# EAGLE design M0_Express_eh_shield_revc (EAGLE 9.6.2)

## Sheet 1 of 2
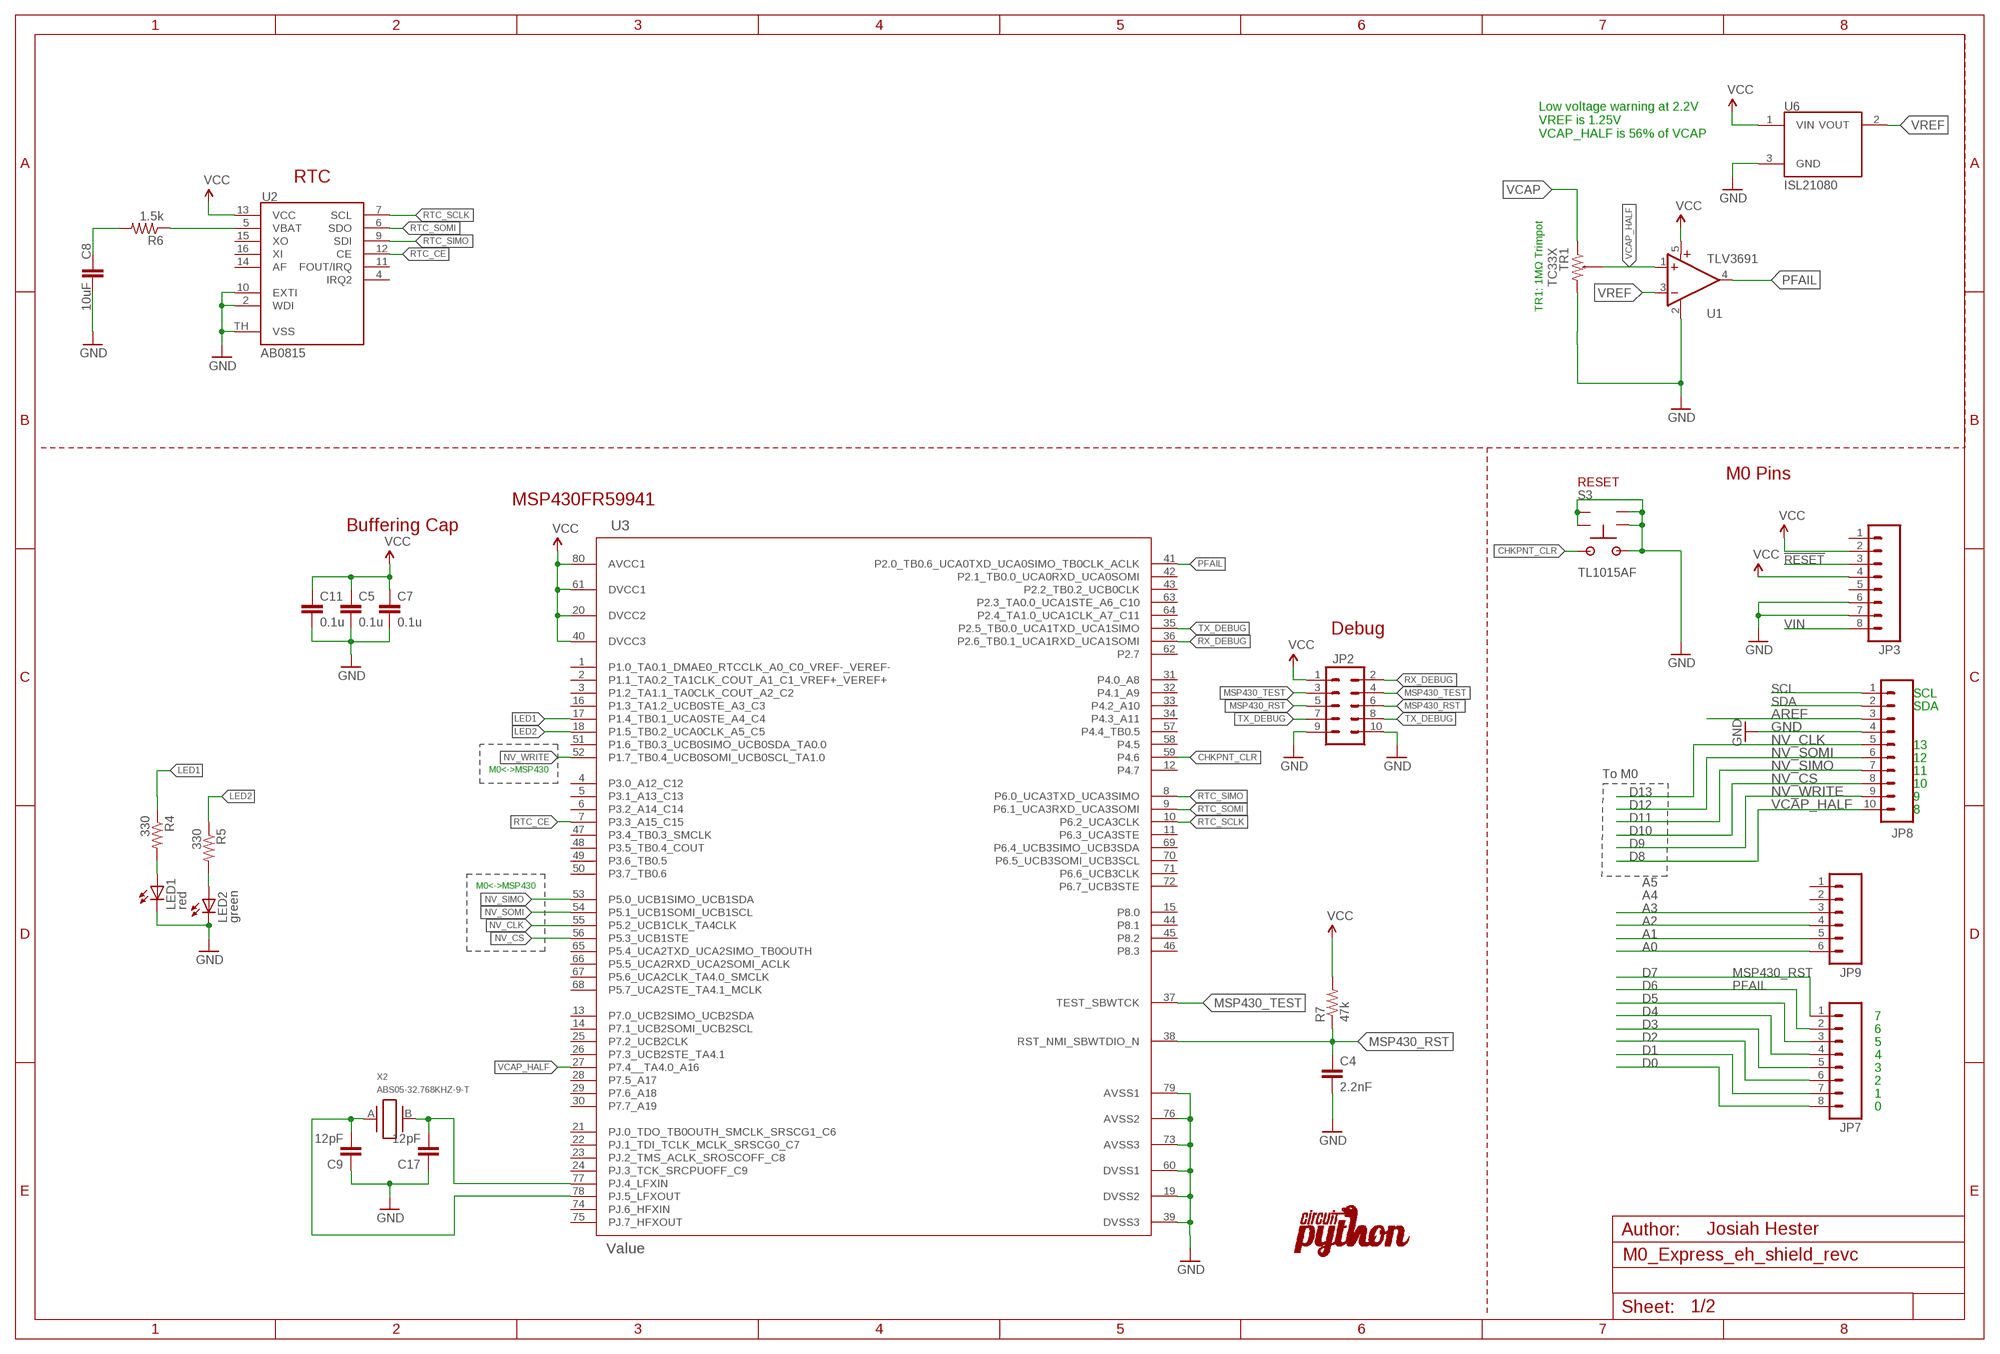
[diagram p0: schematic, sheet 1]

### Parts
C4  2.2nF  C-EU0603  [0603@1]
C5  0.1u  C-EU0603  [0603@1]
C7  0.1u  C-EU0603  [0603@1]
C8  10uF  CAP0805  [0805]
C9  12pF  C-EU0603  [0603@1]
C11  0.1u  C-EU0603  [0603@1]
C17  12pF  C-EU0603  [0603@1]
JP2  M05X21.27MM  [2X5_1.27MM]
JP3  M08LOCK  [1X08_LOCK]
JP7  M08LOCK  [1X08_LOCK]
JP8  M10LOCK  [1X10_LOCK]
JP9  M06LOCK  [1X06_LOCK]
LED1  red  LED0603  [LED-0603]
LED2  green  LED0603  [LED-0603]
R4  330  R-EU0603  [0603]
R5  330  R-EU0603  [0603]
R6  1.5k  R-EU0603  [0603]
R7  47k  R-EU0603  [0603]
S3  TL1015AF  [TS1015]
TR1  TC33X  [TC33X]
U1  TLV3691  [SC70-5]
U2  AB0815  [QFN16]
U3  Value  MSP430FR5994IPNR  [PN0080A_N]
U6  ISL21080  [SOT-23]
U$1  LOGO  [CIRCUITPYTHON-LOGO]
X2  ABS05-32.768KHZ-9-T  [ABS05]

### Nets
!RESET: JP3.3
A0: JP9.6
A1: JP9.5
A2: JP9.4
A3: JP9.3
AREF [aref]: JP8.3
CHKPNT_CLR: S3.2 U3.59(P4.6)
D0: JP7.8
D1: JP7.7
D2: JP7.6
D3: JP7.5
D4: JP7.4
D5: JP7.3
GND [gnd]: C4.2 C5.2 C7.2 C8.2 C9.1 C11.2 C17.1 JP2.9 JP2.10 JP3.6 JP3.7 JP8.4 LED1.C LED2.C S3.1 S3.G1(GND) S3.G2(GND) S3.G3(GND) S3.G4(GND) TR1.2 U1.2(GND) U2.2(WDI) U2.10(EXTI) U2.TH(VSS) U3.19(DVSS2) U3.39(DVSS3) U3.60(DVSS1) U3.73(AVSS3) U3.76(AVSS2) U3.79(AVSS1) U6.3(GND) ; also sheet 2
LED1: R4.1 U3.17(P1.4_TB0.1_UCA0STE_A4_C4)
LED2: R5.1 U3.18(P1.5_TB0.2_UCA0CLK_A5_C5)
MSP430_RST: C4.1 JP2.5 JP2.6 JP7.1 R7.1 U3.38(RST_NMI_SBWTDIO_N)
MSP430_TEST: JP2.3 JP2.4 U3.37(TEST_SBWTCK)
N$3: JP3.2 ; supply symbol labelled VCC
N$4: R6.1 U2.5(VBAT)
N$5: C17.2 U3.77(PJ.4_LFXIN) X2.B
N$6: C9.2 U3.78(PJ.5_LFXOUT) X2.A
N$8: C8.1 R6.2
N$14: LED1.A R4.2
N$15: LED2.A R5.2
NV_CLK: JP8.5 U3.55(P5.2_UCB1CLK_TA4CLK)
NV_CS: JP8.8 U3.56(P5.3_UCB1STE)
NV_SIMO: JP8.7 U3.53(P5.0_UCB1SIMO_UCB1SDA)
NV_SOMI: JP8.6 U3.54(P5.1_UCB1SOMI_UCB1SCL)
NV_WRITE: JP8.9 U3.52(P1.7_TB0.4_UCB0SOMI_UCB0SCL_TA1.0)
PFAIL: JP7.2 U1.4(OUT) U3.41(P2.0_TB0.6_UCA0TXD_UCA0SIMO_TB0CLK_ACLK)
RTC_CE: U2.12(CE) U3.7(P3.3_A15_C15)
RTC_SCLK: U2.7(SCL) U3.10(P6.2_UCA3CLK)
RTC_SIMO: U2.9(SDI) U3.8(P6.0_UCA3TXD_UCA3SIMO)
RTC_SOMI: U2.6(SDO) U3.9(P6.1_UCA3RXD_UCA3SOMI)
RX_DEBUG: JP2.2 U3.36(P2.6_TB0.1_UCA1RXD_UCA1SOMI)
SCL: JP8.1
SDA: JP8.2
TX_DEBUG: JP2.7 JP2.8 U3.35(P2.5_TB0.0_UCA1TXD_UCA1SIMO)
VCAP: TR1.1 ; also sheet 2
VCAP_HALF: JP8.10 TR1.W U1.1(+IN) U3.27(P7.4__TA4.0_A16)
VCC: C5.1 C7.1 C11.1 JP2.1 JP3.4 R7.2 U1.5(V+) U2.13(VCC) U3.20(DVCC2) U3.40(DVCC3) U3.61(DVCC1) U3.80(AVCC1) U6.1(VIN) ; also sheet 2
VIN [USB]: JP3.8
VREF: U1.3(-IN) U6.2(VOUT)
Unconnected: JP3.1 JP3.5 JP9.1 JP9.2 U2.4(IRQ2) U2.11(FOUT/IRQ) U2.14(AF) U2.15(XO) U2.16(XI) U3.1(P1.0_TA0.1_DMAE0_RTCCLK_A0_C0_VREF-_VEREF-) U3.2(P1.1_TA0.2_TA1CLK_COUT_A1_C1_VREF+_VEREF+) U3.3(P1.2_TA1.1_TA0CLK_COUT_A2_C2) U3.4(P3.0_A12_C12) U3.5(P3.1_A13_C13) U3.6(P3.2_A14_C14) U3.11(P6.3_UCA3STE) U3.12(P4.7) U3.13(P7.0_UCB2SIMO_UCB2SDA) U3.14(P7.1_UCB2SOMI_UCB2SCL) U3.15(P8.0) U3.16(P1.3_TA1.2_UCB0STE_A3_C3) U3.21(PJ.0_TDO_TB0OUTH_SMCLK_SRSCG1_C6) U3.22(PJ.1_TDI_TCLK_MCLK_SRSCG0_C7) U3.23(PJ.2_TMS_ACLK_SROSCOFF_C8) U3.24(PJ.3_TCK_SRCPUOFF_C9) U3.25(P7.2_UCB2CLK) U3.26(P7.3_UCB2STE_TA4.1) U3.28(P7.5_A17) U3.29(P7.6_A18) U3.30(P7.7_A19) U3.31(P4.0_A8) U3.32(P4.1_A9) U3.33(P4.2_A10) U3.34(P4.3_A11) U3.42(P2.1_TB0.0_UCA0RXD_UCA0SOMI) U3.43(P2.2_TB0.2_UCB0CLK) U3.44(P8.1) U3.45(P8.2) U3.46(P8.3) U3.47(P3.4_TB0.3_SMCLK) U3.48(P3.5_TB0.4_COUT) U3.49(P3.6_TB0.5) U3.50(P3.7_TB0.6) U3.51(P1.6_TB0.3_UCB0SIMO_UCB0SDA_TA0.0) U3.57(P4.4_TB0.5) U3.58(P4.5) U3.62(P2.7) U3.63(P2.3_TA0.0_UCA1STE_A6_C10) U3.64(P2.4_TA1.0_UCA1CLK_A7_C11) U3.65(P5.4_UCA2TXD_UCA2SIMO_TB0OUTH) U3.66(P5.5_UCA2RXD_UCA2SOMI_ACLK) U3.67(P5.6_UCA2CLK_TA4.0_SMCLK) U3.68(P5.7_UCA2STE_TA4.1_MCLK) U3.69(P6.4_UCB3SIMO_UCB3SDA) U3.70(P6.5_UCB3SOMI_UCB3SCL) U3.71(P6.6_UCB3CLK) U3.72(P6.7_UCB3STE) U3.74(PJ.6_HFXIN) U3.75(PJ.7_HFXOUT)

### Notes on the sheet
- Low voltage warning at 2.2V
  VREF is 1.25V
  VCAP_HALF is 56% of VCAP
- RTC
- TR1: 1MΩ Trimpot
- M0 Pins
- RESET
- MSP430FR59941
- Buffering Cap
- Debug
- SCL
- SDA
- 13
- 12
- 11
- M0<->MSP430
- To M0
- 10
- D13 | 9
- D12 | 8
- D11
- D10
- D9
- D8
- A5
- M0<->MSP430
- A4
- D7
- D6
- 7
- 6
- 5
- 4
- 3
- 2
- 1
- 0
- Josiah Hester

## Sheet 2 of 2
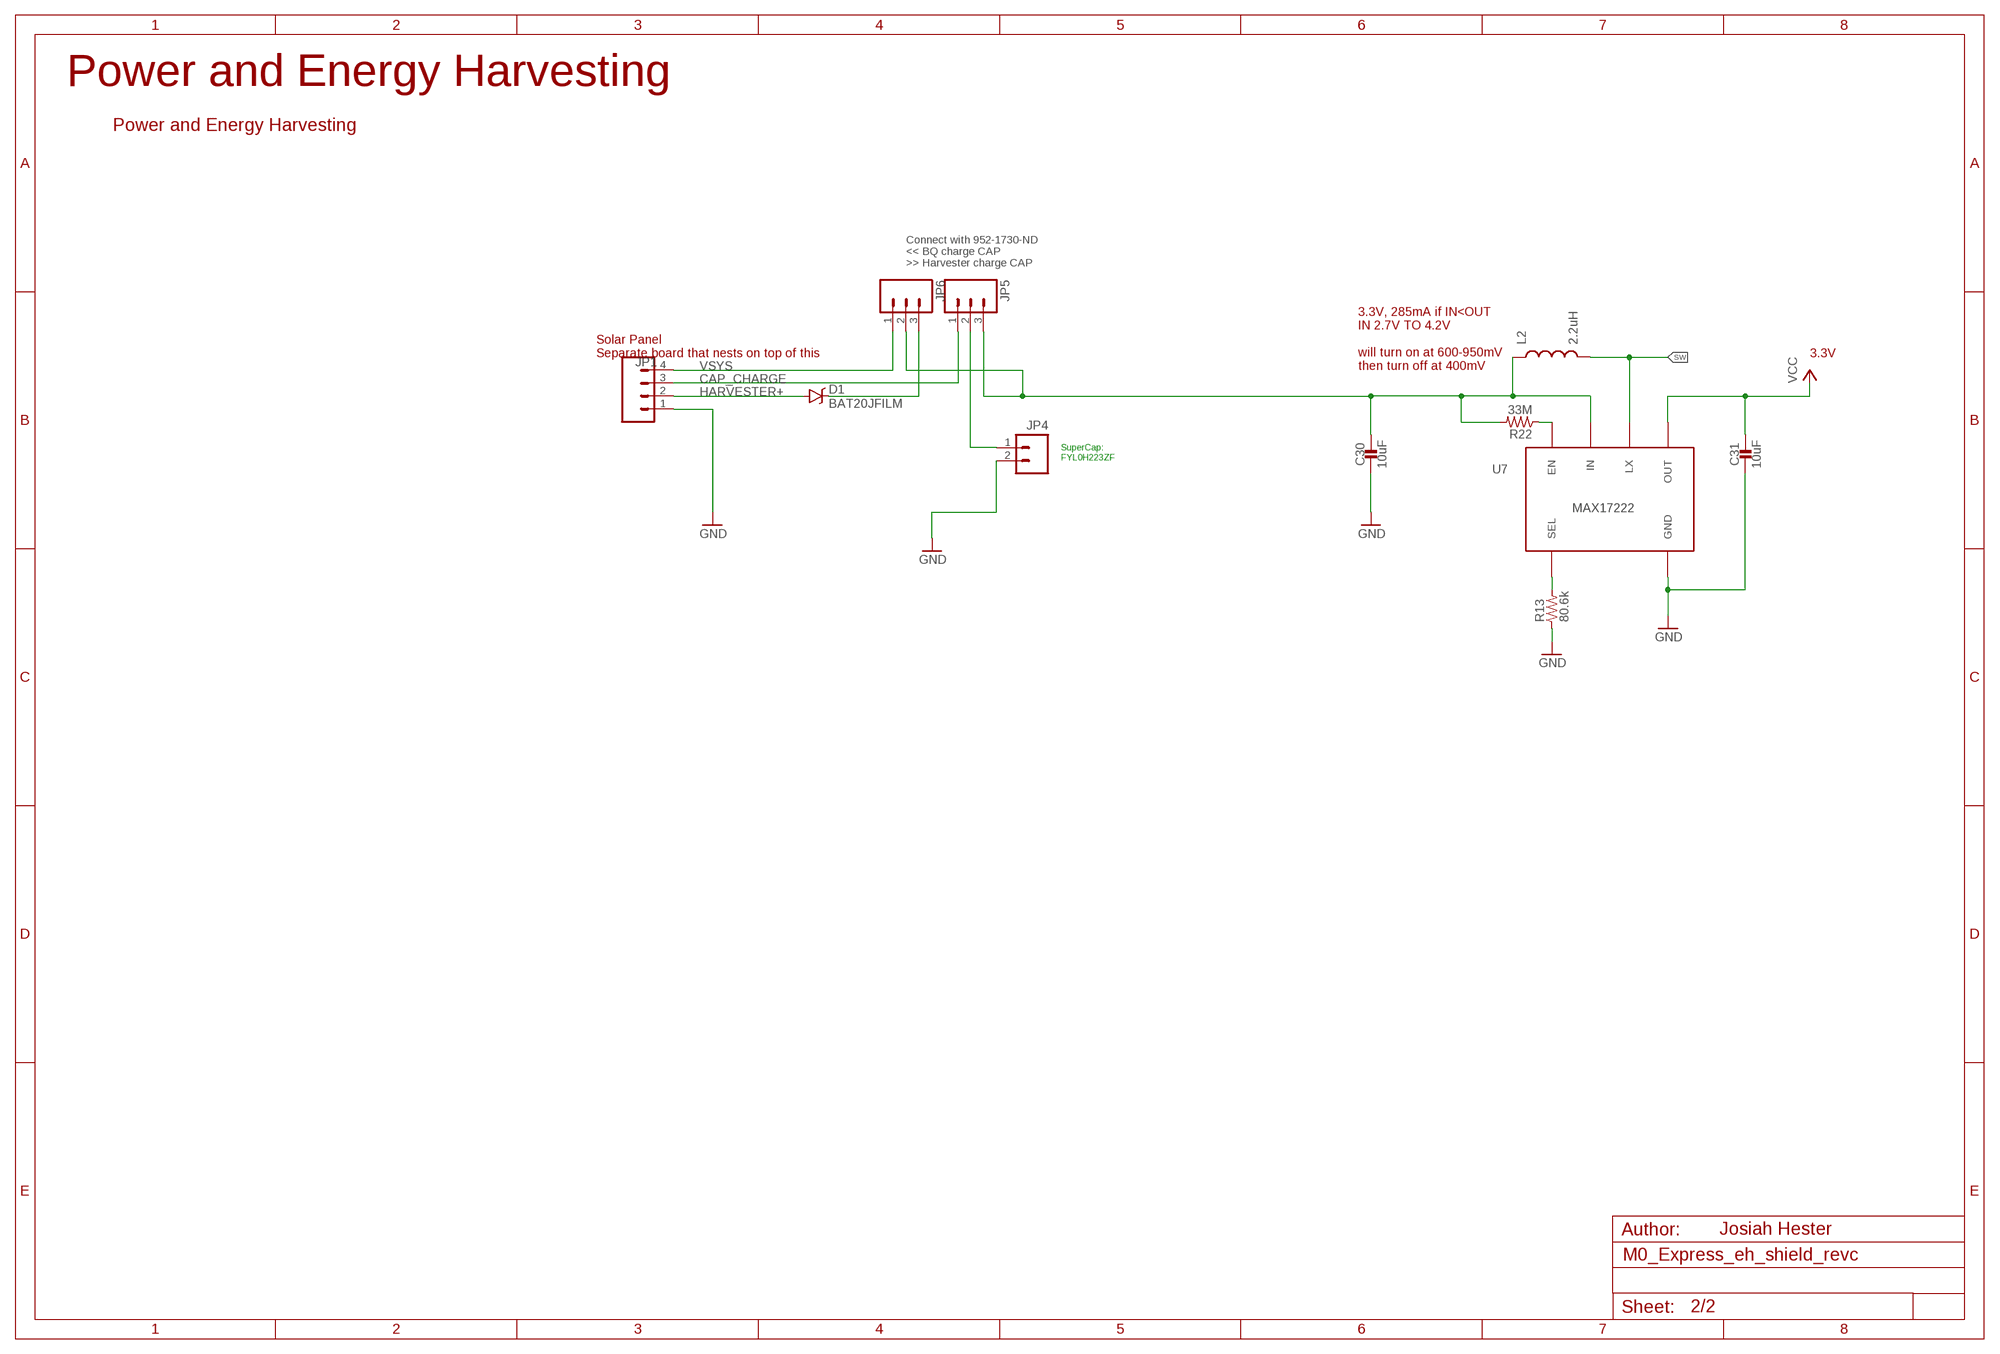
[diagram p1: schematic, sheet 2]

### Parts
C30  10uF  CAPACITOR0603_CAP  [0603_CAP]
C31  10uF  CAPACITOR0603_CAP  [0603_CAP]
D1  BAT20JFILM  [SOD-323]
JP1  M04LOCK  [1X04_LOCK]
JP4  M025MM  [SCREWTERMINAL-5MM-2]
JP5  M03  [1X03-1.27MM]
JP6  M03  [1X03-1.27MM]
L2  2.2uH  INDUCTORWURTH2.2-74438357022  [WURTH-IND-SMD2.2]
R13  80.6k  RESISTOR0603_RES  [0603-RES]
R22  33M  RESISTOR0603_RES  [0603-RES]
U7  MAX17222  [UDFN-6-MAXIM]

### Nets
CAP_CHARGE: JP1.3 JP5.1
GND [gnd]: C30.2 C31.2 JP1.1 JP4.2 R13.1 U7.3(GND) ; also sheet 1
HARVESTER+: D1.A JP1.2
N$1: D1.C JP6.3
N$2: JP4.1 JP5.2
N$9: R22.1 U7.6(EN)
N$12: R13.2 U7.4(SEL)
SW: L2.2 U7.2(LX)
VCAP: C30.1 JP5.3 JP6.2 L2.1 R22.2 U7.5(IN) ; also sheet 1
VCC: C31.1 U7.1(OUT) ; also sheet 1
VSYS: JP1.4 JP6.1

### Notes on the sheet
- Power and Energy Harvesting
- Power and Energy Harvesting
- Connect with 952-1730-ND
  << BQ charge CAP
  >> Harvester charge CAP
- Solar Panel
  Separate board that nests on top of this
- 3.3V
- 3.3V, 285mA if IN<OUT
  IN 2.7V TO 4.2V
  
  will turn on at 600-950mV
  then turn off at 400mV
- SuperCap:
  FYL0H223ZF
- Divider for Lithium Titanate
- Josiah Hester

## Library data of the parts
C4 = tiny_passives:C-EU; DIGIKEY: 478-1219-1-ND; MPN: 06035C222KAT2A
C5 C7 C11 = tiny_passives:C-EU; DIGIKEY: 1276-1005-1-ND; MPN: CL10B104KO8NNNC
C8 = SparkFun-Capacitors:CAP: Capacitor Standard 0603 ceramic capacitor, and 0.1" leaded capacitor.; DIGIKEY: 1276-6456-1-ND
C9 C17 = tiny_passives:C-EU; DIGIKEY: 1276-1254-1-ND; MPN: CL10C120JB8NNNC
C30 C31 = passives:CAPACITOR: SMD Capacitor; DIGIKEY: 490-3896-1-ND; MPN: GRM188R60J106ME47D
D1 = SparkFun-DiscreteSemi:BAT20JFILM: 23V, 1A Schottky diode, SOD-323 package; DIGIKEY: NSR0530HT1GOSCT-ND; PROD_ID: DIO-11623
JP1 = SparkFun-Connectors:M04: Header 4 Standard 4-pin 0.1" header. Use with straight break away headers (SKU : PRT-00116), right angle break away headers (PRT-00553), swiss pins (PRT-00743), machine pins (PRT-00117), and female headers (PRT-00115). Molex polarized connector foot print use with SKU : PRT-08231 with associated crimp pins and housings. 1MM SMD Version SKU: PRT-10208
JP2 = SparkFun-Connectors:M05X2: Header 5x2 Standard 10-pin dual row 0.1" header. Commonly used with AVR-ISP. Use with Spark Fun Electronics SKU: PRT-00778; DIGIKEY: 1175-1627-ND; MPN: 3220-10-0100-00
JP3 JP7 = SparkFun-Connectors:M08: Header 8 Standard 8-pin 0.1" header. Use with straight break away headers (SKU : PRT-00116), right angle break away headers (PRT-00553), swiss pins (PRT-00743), machine pins (PRT-00117), and female headers (PRT-00115).
JP4 = SparkFun-Connectors:M02: Standard 2-pin 0.1" header. Use with - straight break away headers ( PRT-00116) - right angle break away headers (PRT-00553) - swiss pins (PRT-00743) - machine pins (PRT-00117) - female headers (PRT-00115) Molex polarized connector foot print use with: PRT-08233 with associated crimp pins and housings. 2.54_SCREWTERM for use with PRT-10571. 3.5mm Screw Terminal footprints for PRT-08084 5mm Screw Terminal footprints for use with PRT-08432; STOREFRONT_ID: PRT-08432
JP5 JP6 = SparkFun-Connectors:M03: Header 3 Standard 3-pin 0.1" header. Use with straight break away headers (SKU : PRT-00116), right angle break away headers (PRT-00553), swiss pins (PRT-00743), machine pins (PRT-00117), and female headers (PRT-00115). Molex polarized connector foot print use with SKU : PRT-08232 with associated crimp pins and housings.
JP8 = SparkFun-Connectors:M10: Header 10 Standard 10-pin 0.1" header. Use with straight break away headers (SKU : PRT-00116), right angle break away headers (PRT-00553), swiss pins (PRT-00743), machine pins (PRT-00117), and female headers (PRT-00115).
JP9 = SparkFun-Connectors:M06: Header 6 Standard 6-pin 0.1" header. Use with straight break away headers (SKU : PRT-00116), right angle break away headers (PRT-00553), swiss pins (PRT-00743), machine pins (PRT-00117), and female headers (PRT-00115). Molex polarized connector foot print use with SKU : PRT-08094 with associated crimp pins and housings. NOTES ON THE VARIANTS LOCK and LOCK_LONGPADS... This footprint was designed to help hold the alignment of a through-hole component (i.e. 6-pin header) while soldering it into place. You may notice that each hole has been shifted either up or down by 0.005 of an inch from it's more standard position (which is a perfectly straight line). This slight alteration caused the pins (the squares in the middle) to touch the edges of the holes. Because they are alternating, it causes a "brace" to hold the component in place. 0.005 has proven to be the perfect amount of "off-center" position when using our standard breakaway headers. Although looks a little odd when you look at the bare footprint, once you have a header in there, the alteration is very hard to notice. Also,if you push a header all the way into place, it is covered up entirely on the bottom side. This idea of altering the position of holes to aid alignment will be further integrated into the Sparkfun Library for other footprints. It can help hold any component with 3 or more connection pins.
L2 = SparkFun-Passives:INDUCTOR: Inductors Basic Inductor/Choke - 0603 and 1206. Footprints are not proven and vary greatly between part numbers. INDUCTOR POWER 3.3UH 4.0A SMD 0.197" L x 0.197" W x 0.177" H (5.00mm x 5.00mm x 4.50mm); DIGIKEY: 732-11201-1-ND; MANUFACTURER: Würth Elektronik; MPN: 74438357022
LED1 LED2 = SparkFun-LED:LED: LEDs Standard schematic elements and footprints for 5mm, 3mm, 1206, and 0603 sized LEDs. 5mm - Spark Fun Electronics SKU : COM-00529 (and others)
R4 R5 = tiny_passives:R-EU
R6 = tiny_passives:R-EU; DIGIKEY: A121524CT-ND; MPN: CRG0603F1K5
R7 = tiny_passives:R-EU; DIGIKEY: 541-4061-1-ND; MPN: CRCW060347K0JNEAC
R13 = passives:RESISTOR: Resistor Basic schematic elements and footprints for 0201, 0402, 0603, 1206, and PTH resistors.; DIGIKEY: 311-80.6KHRCT-ND; MPN: RC0603FR-0780K6L
R22 = passives:RESISTOR: Resistor Basic schematic elements and footprints for 0201, 0402, 0603, 1206, and PTH resistors.; DIGIKEY: HMC0603JT33M0CT-ND; MPN: HMC0603JT33M0
S3 = eswitch:TL1015AF; MPN: TL1015AF160QG
TR1 = bourns_tc33_trimpots:TC33X; DIGIKEY: TC33X-2-105ECT-ND; MPN: TC33X-2-105E
U1 = tlv3691:TLV3691: 0.9-V to 6.5-V, Nanopower Comparator Datasheets Analog Signal Chain Guide <http://www.ti.com/lit/pdf/slyb174> TLV3691 <http://www.ti.com/lit/ds/symlink/tlv3691.pdf> Manufacturer Product Page TLV3691IDPFR Specifications <http://www.ti.com/general/docs/suppproductinfo.tsp?distId=10&orderablePartNumber=TLV3691IDPFR> Standard Package <javascript:dlgHelp('Standard%20Packaging%20Help');> 1 Category Integrated Circuits (ICs) </product-search/en/integrated-circuits-ics> Family Linear - Comparators </product-search/en/integrated-circuits-ics/linear-comparators/2556221> Series - Packaging <javascript:dlgHelp('Standard%20Packaging%20Help');> Cut Tape (CT) <javascript:dlgHelp('Cut%20Tape%20Help');> Type General Purpose Number of Elements 1 Output Type Push-Pull Voltage - Supply, Single/Dual (±) 0.9 V ~ 6.5 V, ±0.45 V ~ 3.25 V Voltage - Input Offset (Max) 3mV Current - Input Bias (Max) 100pA Current - Output (Typ) 42mA Current - Quiescent (Max) 150nA CMRR, PSRR (Typ) - Propagation Delay (Max) 35µs Hysteresis - Operating Temperature -40°C ~ 125°C Package / Case 6-XFDFN Mounting Type Surface Mount Supplier Device Package 6-X2SON (1x1) Online Catalog Comparators - 1 element </catalog/en/partgroup/comparators-1-element/3112?mpart=TLV3691IDPFR&vendor=296&WT.z_ref_page_type=PS&WT.z_ref_page_sub_type=PD&WT.z_ref_page_id=PD&WT.z_ref_page_event=DC_Link_Table> Other Names 296-37242-1; DIGIKEY: 296-37910-1-ND; MPN: TLV3691IDCKR
U2 = AB08XX:AB0815: AB08X5 Real-Time Clock Family: SPI The ABRACON AB08X5 Real-Time Clock family provides a groundbreaking combination of ultra-low power coupled with a highly sophisticated feature set. With power requirements significantly lower than any other industry RTC (as low as 14 nA), these are the first semiconductors based on innovative SPOTTM (Subthreshold Power Optimized Technology) CMOS platform. The AB08X5 includes on-chip oscillators to provide minimum power consumption, full RTC functions including battery backup and programmable counters and alarms for timer and watchdog functions, and either an I2C or SPI serial interface for communication with a host controller.; DIGIKEY: 535-11930-1-ND; MPN: AB0815-T3
U3 = msp430fr5994:MSP430FR5994IPNR; DIGIKEY: 296-45561-1-ND; MANUFACTURER: Texas Instruments; PARTNUMBER: MSP430FR5994IPNR; REFDES: RefDes; TYPE: TYPE
U6 = isl21080:ISL21080: Intersil: ISL21080, 300nA NanoPower Voltage References The ISL21080 analog voltage references feature low supply voltage operation at ultra-low 310nA typ, 1.5µA max operating current. Additionally, the ISL21080 family features guaranteed initial accuracy as low as ±0.2% and 50ppm/°C temperature coefficient. These references are ideal for general purpose portable applications to extend battery life at lower cost. The ISL21080 is provided in the industry standard 3 Ld SOT-23 pinout. The ISL21080 output voltages can be used as precision voltage sources for voltage monitors, control loops, standby voltages for low power states for DSP, FPGA, Datapath Controllers, microcontrollers and other core voltages: 0.9V, 1.024V, 1.25V, 1.5V, 2.048V, 2.5V, 3.0V, 3.3V, 4.096V and 5.0V. Special Note: Post-assembly x-ray inspection may lead to permanent changes in device output voltage and should be minimized or avoided. For further information, please see “Applications Information” on page 14 and AN1533, “X-Ray Effects on Intersil FGA References”.; DIGIKEY: ISL21080DIH312Z-TKTR-ND; MPN: ISL21080DIH312Z-TK
U7 = chips:MAX17222: Very high efficiency, very low power boost converter suitable for EH applications; DIGIKEY: MAX17222ELT+TCT-ND; MANUFACTURER: MAXIM INTEGRATED; MPN: MAX17222ELT+T
U$1 = circuitpython-logo:LOGO
X2 = abs05:ABS05-32.768KHZ: 32.768kHz Crystal; DIGIKEY: 535-11897-1-ND; MPN: ABS05-32.768KHZ-9-T

## Board
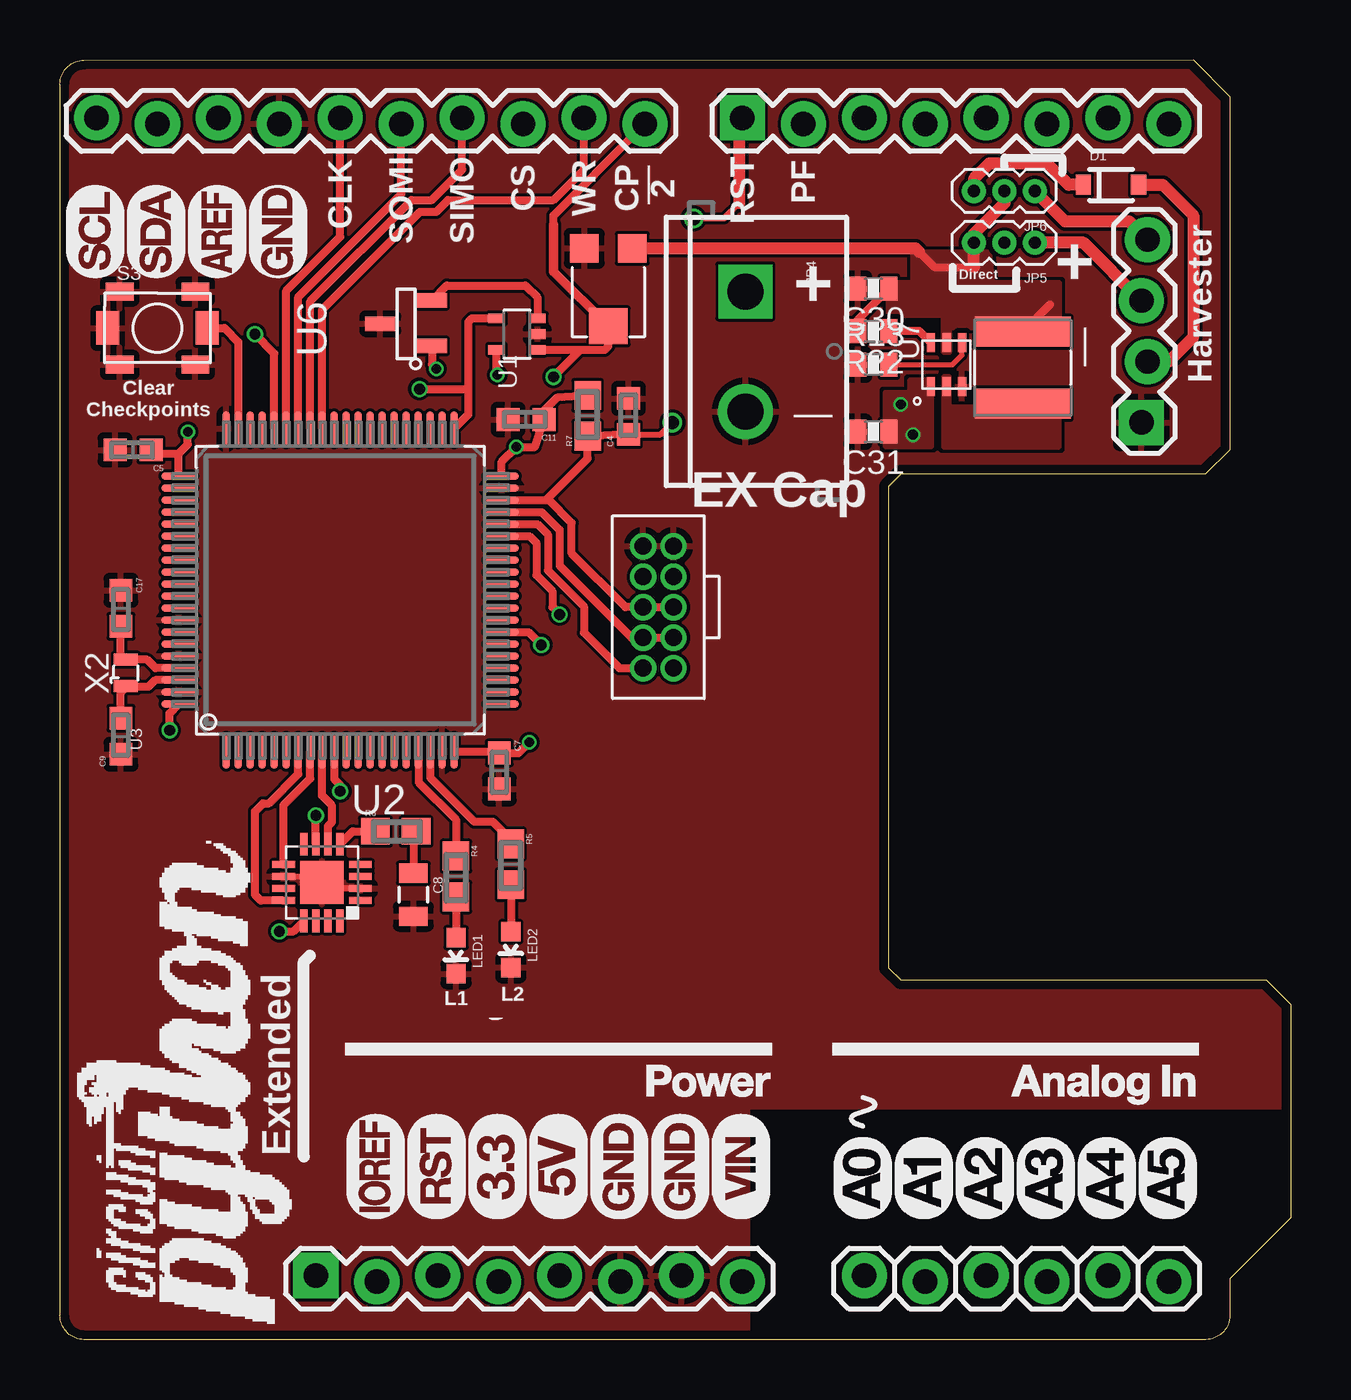
[diagram p2: board, top side]
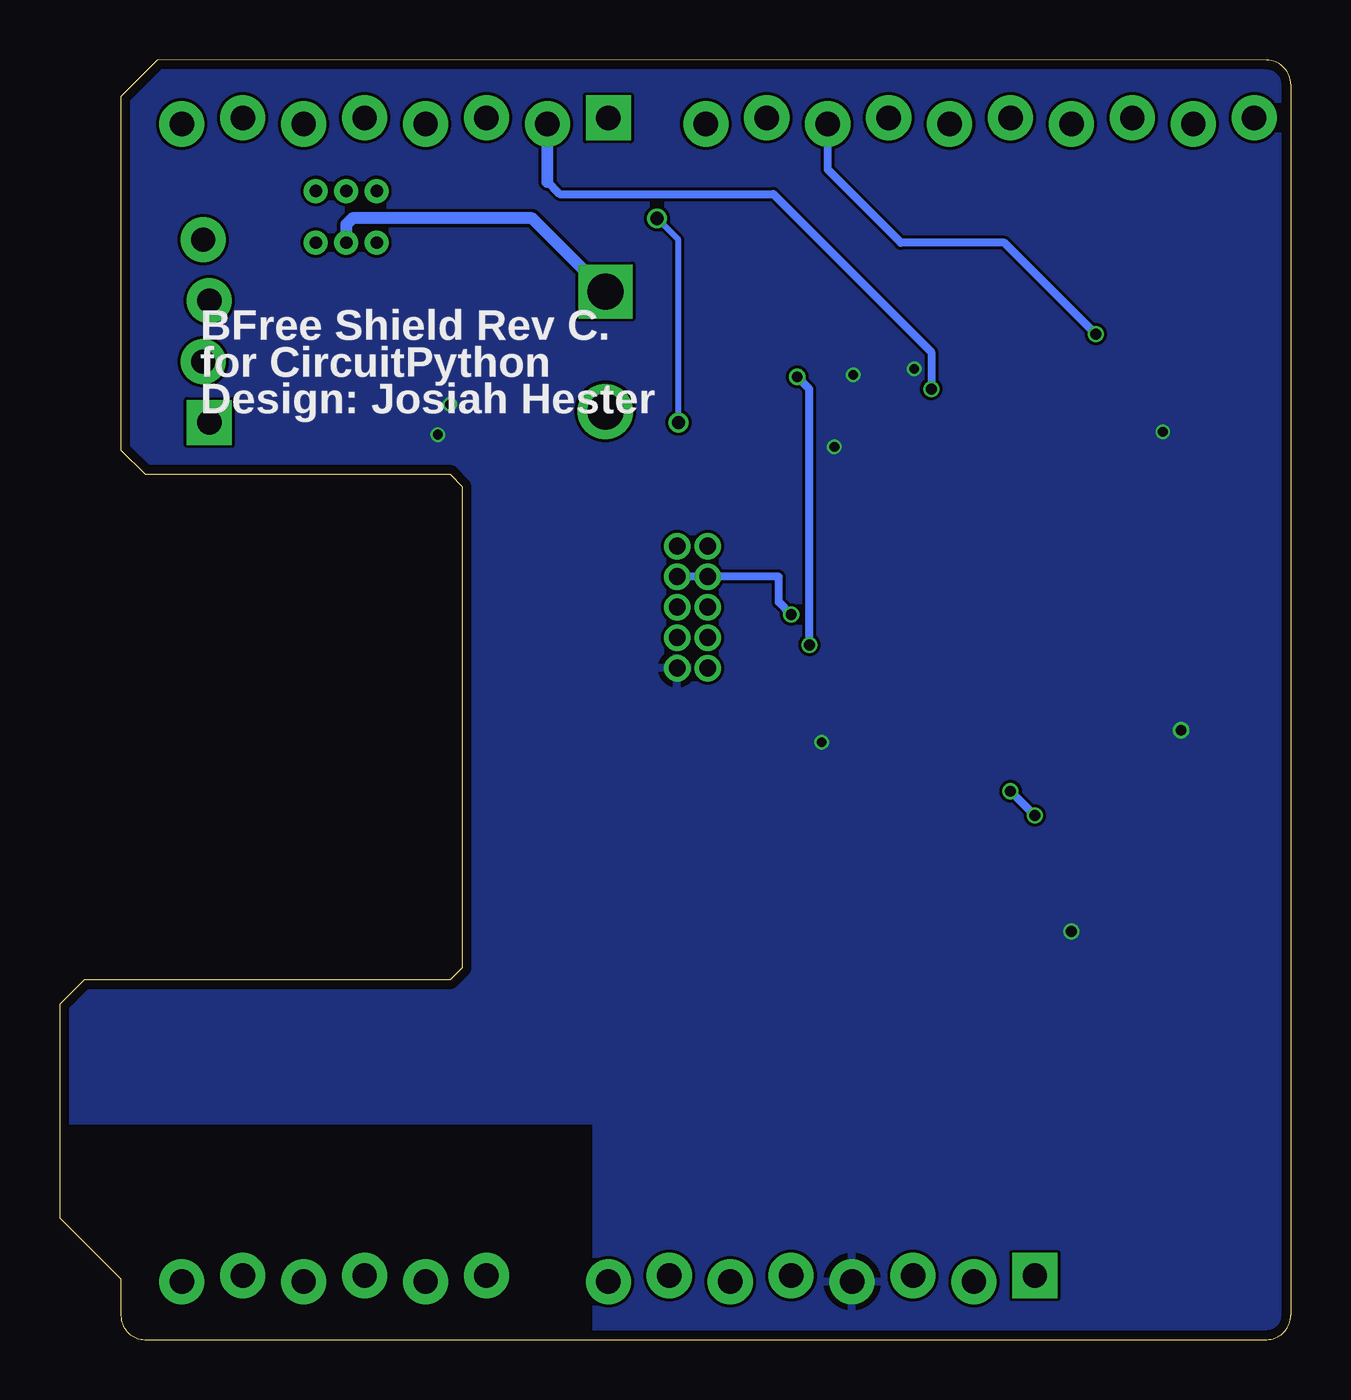
[diagram p3: board, bottom side, seen from below]

Size 51.31 x 53.34 mm. Coordinates in mm from the lower left corner, seen from the top.
Outline: 47.24,53.34 48.77,51.82 48.77,37.08 47.75,36.07 35.05,36.07 34.54,35.56 34.54,15.49 35.05,14.99 50.29,14.99 51.31,13.97 51.31,5.08 48.77,2.54 48.77,1 arc-90 47.77,0 1,0 arc-90 0,1.02 0,52.32 arc-90 1,53.32 47.24,53.34
Copper layers (1*16): Top 0.035559375mm / dielectric 0.17018125mm / Bottom 0.035559375mm
Design rules "oshpark-4layer *": minimum track width 5mil, minimum drill 10mil, track to track 5mil, track to pad 5mil, pad to pad 5mil, via to via 5mil, smd to smd 5mil, copper to edge 15mil, drill to drill 6mil, minimum pad ring 4mil, minimum via ring 4mil, stop-mask expansion 2.5mil, vias tented up to drill 0mil, thermal gap 10mil
tKeepout: area 76.4,1 to 76.5,1.5
tRestrict: area 74.9,2 to 75.4,2; area 74.9,1.5 to 75.4,1.5; area 75.4,1 to 75.5,1.5; area 83.1,1.3 to 83.2,1.8

### Footprints (pad centres in the part's own frame; a part is rotated, then mirrored left to right if it is on the bottom)
0603@1 = smd 0.95 x 0.95: 1 -0.75,0; 2 0.75,0
0805 = smd 0.8 x 1.2: 1 -0.9,0; 2 0.9,0
0603_CAP = smd 0.7 x 1: 1 -0.65,0; 2 0.65,0
SOD-323 = smd 0.63 x 0.83: A 1.15,0; C -1.15,0
1X04_LOCK = drill 1.016 pad 1.88 square: 1 0,0.127 | drill 1.016 pad 1.88: 2 2.54,-0.127; 3 5.08,0.127; 4 7.62,-0.127
2X5_1.27MM = drill 0.7 pad 1.1: 1 0,0; 2 1.27,0; 3 0,-1.27; 4 1.27,-1.27; 5 0,-2.54; 6 1.27,-2.54; 7 0,-3.81; 8 1.27,-3.81; 9 0,-5.08; 10 1.27,-5.08
1X08_LOCK = drill 1.016 pad 1.88 square: 1 0,0.127 | drill 1.016 pad 1.88: 2 2.54,-0.127; 3 5.08,0.127; 4 7.62,-0.127; 5 10.16,0.127; 6 12.7,-0.127; 7 15.24,0.127; 8 17.78,-0.127
SCREWTERMINAL-5MM-2 = drill 1.5 pad 2.232 square: 1 0,0 | drill 1.5 pad 2.3: 2 5,0
1X03-1.27MM = drill 0.508 pad 1: 1 -1.27,0; 2 0,0; 3 1.27,0
1X10_LOCK = drill 1.016 pad 1.88: 1 0,0.127; 2 2.54,-0.127; 3 5.08,0.127; 4 7.62,-0.127; 5 10.16,0.127; 6 12.7,-0.127; 7 15.24,0.127; 8 17.78,-0.127; 9 20.32,0.127; 10 22.86,-0.127
1X06_LOCK = drill 1.016 pad 1.88: 1 0,0; 2 2.54,-0.254; 3 5.08,0; 4 7.62,-0.254; 5 10.16,0; 6 12.7,-0.254
WURTH-IND-SMD2.2 = smd 1.25 x 4: 1 -1.5,0; 2 1.5,0
LED-0603 = smd 0.8 x 0.8: A 0,-0.75; C 0,0.75
0603 = smd 1.2 x 1.1: 1 -0.85,0; 2 0.85,0
0603-RES = smd 0.7 x 1: 1 -0.65,0; 2 0.65,0
TS1015 = smd 0.95 x 1.4: 1 -2.075,0; 2 2.075,0 | smd 1.15 x 0.75: G1 -1.575,1.525; G2 1.575,1.525; G3 -1.575,-1.525; G4 1.575,-1.525
TC33X = smd 1.2 x 1.2: 1 -1,-1.8; 2 1,-1.8 | smd 1.6 x 1.5: W 0,1.45
SC70-5 = smd 0.4 x 0.7: 1 -0.65,-0.85; 2 0,-0.85; 3 0.65,-0.85; 4 0.65,0.85; 5 -0.65,0.85
QFN16 = smd 0.95 x 0.3: 1 -1.6,0.75; 2 -1.6,0.25; 3 -1.6,-0.25; 4 -1.6,-0.75; 9 1.6,-0.75; 10 1.6,-0.25; 11 1.6,0.25; 12 1.6,0.75 | smd 0.3 x 0.95: 5 -0.75,-1.6; 6 -0.25,-1.6; 7 0.25,-1.6; 8 0.75,-1.6; 13 0.75,1.6; 14 0.25,1.6; 15 -0.25,1.6; 16 -0.75,1.6 | smd 1.8 x 1.8: TH 0,0
PN0080A_N = smd 1.448 x 0.305: 1 -6.725,4.75; 2 -6.725,4.25; 3 -6.725,3.75; 4 -6.725,3.25; 5 -6.725,2.75; 6 -6.725,2.25; 7 -6.725,1.75; 8 -6.725,1.25; 9 -6.725,0.75; 10 -6.725,0.25; 11 -6.725,-0.25; 12 -6.725,-0.75; 13 -6.725,-1.25; 14 -6.725,-1.75; 15 -6.725,-2.25; 16 -6.725,-2.75; 17 -6.725,-3.25; 18 -6.725,-3.75; 19 -6.725,-4.25; 20 -6.725,-4.75; 41 6.725,-4.75; 42 6.725,-4.25; 43 6.725,-3.75; 44 6.725,-3.25; 45 6.725,-2.75; 46 6.725,-2.25; 47 6.725,-1.75; 48 6.725,-1.25; 49 6.725,-0.75; 50 6.725,-0.25; 51 6.725,0.25; 52 6.725,0.75; 53 6.725,1.25; 54 6.725,1.75; 55 6.725,2.25; 56 6.725,2.75; 57 6.725,3.25; 58 6.725,3.75; 59 6.725,4.25; 60 6.725,4.75 | smd 0.305 x 1.448: 21 -4.75,-6.725; 22 -4.25,-6.725; 23 -3.75,-6.725; 24 -3.25,-6.725; 25 -2.75,-6.725; 26 -2.25,-6.725; 27 -1.75,-6.725; 28 -1.25,-6.725; 29 -0.75,-6.725; 30 -0.25,-6.725; 31 0.25,-6.725; 32 0.75,-6.725; 33 1.25,-6.725; 34 1.75,-6.725; 35 2.25,-6.725; 36 2.75,-6.725; 37 3.25,-6.725; 38 3.75,-6.725; 39 4.25,-6.725; 40 4.75,-6.725; 61 4.75,6.725; 62 4.25,6.725; 63 3.75,6.725; 64 3.25,6.725; 65 2.75,6.725; 66 2.25,6.725; 67 1.75,6.725; 68 1.25,6.725; 69 0.75,6.725; 70 0.25,6.725; 71 -0.25,6.725; 72 -0.75,6.725; 73 -1.25,6.725; 74 -1.75,6.725; 75 -2.25,6.725; 76 -2.75,6.725; 77 -3.25,6.725; 78 -3.75,6.725; 79 -4.25,6.725; 80 -4.75,6.725
SOT-23 = smd 0.6 x 1.25: 1 -0.95,-1.075; 2 0.95,-1.075; 3 -0.025,1.075
UDFN-6-MAXIM = smd 0.8 x 0.35: 1 -0.915,0.65; 2 -0.915,0; 3 -0.915,-0.65; 4 0.915,-0.65; 5 0.915,0; 6 0.915,0.65
ABS05 = smd 0.5 x 1: A -0.55,0; B 0.55,0

### Placement (x,y rotation side)
C4  23.7,38.48 90 top
C5  3.05,37.08 180 top
C7  18.31,23.7 270 top
C8  14.73,18.54 270 top
C9  2.54,25.15 90 top
C11  19.43,38.35 180 top
C17  2.54,30.48 270 top
C30  33.91,43.81 180 top
C31  33.91,37.85 180 top
D1  43.82,48.13 0 top
JP1  45.21,38.23 90 top
JP2  25.58,27.99 180 top
JP3  10.67,2.54 0 top
JP4  28.57,43.69 270 top
JP5  39.37,45.72 180 top
JP6  39.37,47.88 180 top
JP7  28.45,50.8 0 top
JP8  1.52,50.8 0 top
JP9  46.23,2.41 180 top
L2  40.13,40.51 270 top
LED1  16.51,16 180 top
LED2  18.8,16.26 180 top
R4  16.51,19.3 270 top
R5  18.8,19.81 270 top
R6  14,21.18 0 top
R7  22,38.51 90 top
R13  33.91,40.64 0 top
R22  33.91,42.04 180 top
S3  4.06,42.16 0 top
TR1  22.86,43.69 180 top
U1  19.05,41.91 90 top
U2  10.92,19.05 180 top
U3  11.68,31.24 90 top
U6  14.43,42.37 90 top
U7  36.96,40.64 90 top
U$1  10.41,0.51 90 top
X2  2.74,27.79 90 top

### Tracks (layer width: path | path; a pad name or v marks a point on that pad's centre or on a via)
CAP_CHARGE
  Top 0.508: JP1.3 42.67,45.72 JP5.1
CHKPNT_CLR
  Top 0.33: S3.2 6.86,42.16 7.43,41.59 U3.59
GND
  Top 0.254: U2.10 10.67,19.3 U2.TH 11.17,18.8 U2.2
  pour Top (rank 5): -0.25,53.59 53.09,53.59 53.09,10.92 51.82,9.65 28.7,9.65 28.7,-0.76 -1.27,-0.76 -1.27,53.59
HARVESTER+
  Top 0.508: D1.A 45.97,48.13 47.24,46.86 47.24,41.78 46.23,40.77 JP1.2
LED1
  Top 0.33: U3.17 14.95,24.5 14.95,23.23 16.51,21.67 R4.1
LED2
  Top 0.33: U3.18 15.43,23.43 17.27,21.59 18.03,21.59 18.8,20.83 R5.1
MSP430_RST  (via drill 0.55)
  Top 0.254: C4.1 25.03,37.73 v25.53,38.23 | v26.42,46.74 27.69,46.74 28.32,47.37
  Top 0.33: U3.38 20.26,34.99 | 20.26,34.99 22,36.73 R7.1 23.67,37.76 C4.1 | 20.26,34.99 20.38,34.99 21.34,34.04 21.34,32.77 23.57,30.53 JP2.6 JP2.5
  Top 0.508: 28.32,47.37 28.32,50.8 JP7.1
  Bottom 0.254: v25.53,38.23 25.53,45.85 v26.42,46.74
MSP430_TEST
  Top 0.33: JP2.3 JP2.4 23.82,29.26 20.83,32.26 20.83,33.75 20.08,34.49 U3.37
N$1
  Top 0.508: D1.C 42.04,48.13 41.15,49.02 38.73,49.02 38.1,48.39 JP6.3
N$2
  Bottom 0.508: JP4.1 31.62,46.74 39.12,46.74 39.37,46.48 JP5.2
N$4
  Top 0.33: U2.5 12.21,21.18 R6.1
N$5
  Top 0.33: U3.77 3.99,27.99 3.63,28.35 2.75,28.35 X2.B 2.54,28.54 C17.2
N$6
  Top 0.33: U3.78 3.97,27.49 3.68,27.2 2.78,27.2 | 2.78,27.2 X2.A | C9.2 2.54,26.97 2.78,27.2
N$8
  Top 0.33: R6.2 14.73,21.17 C8.1
N$9
  Top 0.33: U7.6 35.83,42.04 R22.1
N$12
  Top 0.203: R13.2 37.21,40.64 37.61,41.04 U7.4
N$14
  Top 0.33: R4.2 LED1.A
N$15
  Top 0.33: R5.2 LED2.A
NV_CLK
  Top 0.33: U3.55 9.43,43.72 11.68,45.97 JP8.5
NV_CS  (via drill 0.45)
  Top 0.33: U3.56 8.93,41.1 v8.13,41.91
  Bottom 0.33: v8.13,41.91 11.94,45.72 16.26,45.72 19.3,48.77 JP8.8
NV_SIMO
  Top 0.33: U3.53 10.43,43.28 14.65,47.5 15.49,47.5 16.76,48.77 JP8.7
NV_SOMI
  Top 0.33: U3.54 9.93,43.46 14.22,47.75 JP8.6
NV_WRITE
  Top 0.33: U3.52 10.93,42.94 15.01,47.02 15.69,47.02 16.18,47.5 20.57,47.5 21.84,48.77 JP8.9
PFAIL  (via drill 0.45)
  Top 0.33: U1.4 17.16,42.56 17.02,42.42 17.02,39.62 | U3.41 17.02,38.55 17.02,39.62 | v14.99,39.62 17.02,39.62
  Bottom 0.33: 30.99,48.26 30.48,47.75 21.57,47.75 14.99,41.17 v14.99,39.62
  Bottom 0.508: 30.99,48.26 JP7.2
RTC_CE
  Top 0.33: U2.12 8.37,18.3 8.13,18.54 8.13,22.02 8.46,22.35 8.72,22.35 9.93,23.57 U3.7
RTC_SCLK  (via drill 0.45)
  Top 0.33: U2.7 v10.67,21.84 | v11.68,22.86 11.68,23.11 11.43,23.36 U3.10
  Bottom 0.33: v10.67,21.84 v11.68,22.86
RTC_SIMO
  Top 0.33: U2.9 9.32,22.28 10.43,23.39 U3.8
RTC_SOMI
  Top 0.33: U2.6 11.17,21.4 11.34,21.57 11.34,22.26 10.92,22.68 10.92,24.51 U3.9
RX_DEBUG
  Top 0.33: U3.36 19.9,33.99 20.34,33.55 20.34,32.06 21.84,30.56 21.84,29.46 23.32,27.99 JP2.2
SW
  pour Top (isolate 0.203, no thermals): 36.83,40.13 36.83,37.21 41.66,37.21 41.66,38.86 37.08,38.86 37.08,40.13
TX_DEBUG  (via drill 0.45)
  Top 0.33: v20.83,30.23 20.53,30.53 20.53,31.2 19.86,31.86 19.86,33.2 19.57,33.49 U3.35
  Bottom 0.33: v20.83,30.23 21.34,30.73 21.34,31.8 JP2.8 JP2.7
VCAP
  Top 0.33: 41.27,43.15 L2.1 | C30.1 33.26,42.52 R22.2 | 35.81,45.34 36.45,44.7 38.1,44.7
  Top 0.508: JP6.2 39.37,47.37 38.1,46.1 JP5.3 38.1,44.7 | TR1.1 35.66,45.49 35.81,45.34
  pour Top (isolate 0.203, rank 2, no thermals): 36.83,41.15 36.83,42.67 34.54,42.67 34.54,44.07 35.56,44.07 35.56,45.34 38.73,45.34 38.88,44.07 41.66,44.07 41.66,42.16 37.08,42.16 37.08,41.15
VCAP_HALF  (via drill 0.45)
  Top 0.33: U3.27 19.53,29.49 v20.07,28.96 | U1.1 21.7,41.26 | TR1.W 22.86,41.4 22.72,41.26 21.7,41.26 | v20.57,40.13 21.7,41.26 | JP8.10 22.3,48.59 22.3,48.58 20.57,46.85 20.57,46.48
  Top 0.4: TR1.W 20.57,44.52 20.57,46.48
  Bottom 0.33: v20.07,28.96 20.07,39.62 v20.57,40.13
VCC  (via drill 0.4, 0.41, 0.45)
  Top 0.33: v18.24,40.21 18.2,40.24 U1.5 | U6.1 15.5,40.66 v15.7,40.46 | R7.2 20.71,39.26 20.18,38.72 C11.1 19.8,37.21 v19.02,37.21 18.41,36.59 U3.40 | U3.61 4.96,36.94 | U3.20 18.24,24.52 C7.1 19.11,24.45 v19.56,24.89 | v4.57,25.4 4.57,26.11 U3.80 | v9.14,17.02 9.74,17.02 U2.13 | 4.96,36.94 5.33,37.31 v5.33,37.85 | C5.1 3.94,36.94 4.96,36.94
  other vias: 35.05,38.99 35.56,37.72
  pour Bottom: -0.76,54.36 52.07,54.36 52.07,9.14 28.96,9.14 28.96,-0.76 -0.25,-0.76 -0.76,-0.76
  pour Top (isolate 0.203, no thermals): 35.43,40 36.32,40 36.32,37.21 34.42,37.21 34.42,39.5 35.43,39.5
VREF
  Top 0.33: U6.2 16.13,43.94 19.41,43.94 19.9,43.45 U1.3
VSYS
  Top 0.508: JP1.4 44.58,46.61 41.91,46.61 JP6.1

### Text on the board
tPlace: CS | WR | _ | CP / 2 | RST | PF | CLK | SOMI | SIMO | + | + | Direct | Harvester | _ | _ | Clear / Checkpoints | EX Cap | L1 | L2 | Extended
bPlace: BFree Shield Rev C. / for CircuitPython / Design: Josiah Hester
214bmp: D:/SmartProjects/Snc/a4_bn_logo2.bmp